# Altium schematic sheet Connections.SchDoc
size A; SheetNumber: 2; SheetTotal: 2
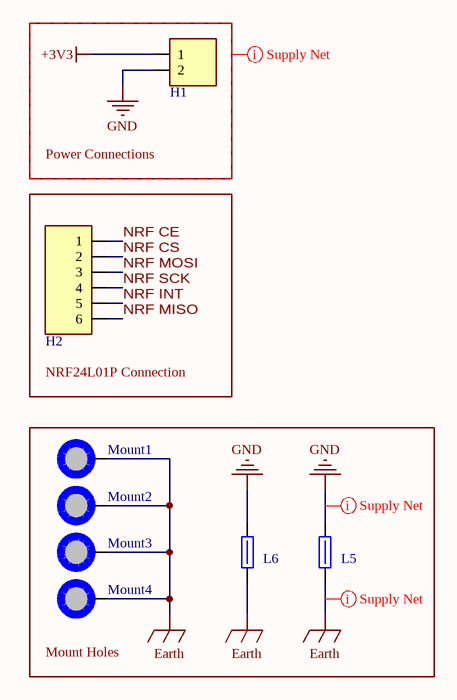
[diagram p0: Connections.SchDoc]

## Parts
H1  1x2 Male  [[Header] Shrouded 1x2 Male]  (value not drawn)
H2  [Header] Shrouded 1x6 Male  [[Header] Shrouded 1x6 Male]  (value not drawn)
L5  652-MH2029-300Y  [[Ferrite] SMD Bead 0805 (1)]  (value not drawn)
L6  652-MH2029-300Y  [[Ferrite] SMD Bead 0805 (1)]  (value not drawn)
Mount1  M3 Mount Hole  [[Mount] M3 Mount Hole]  (value not drawn)  (no BOM)
Mount2  M3 Mount Hole  [[Mount] M3 Mount Hole]  (value not drawn)  (no BOM)
Mount3  M3 Mount Hole  [[Mount] M3 Mount Hole]  (value not drawn)  (no BOM)
Mount4  M3 Mount Hole  [[Mount] M3 Mount Hole]  (value not drawn)  (no BOM)

## Blocks framed on the sheet
Power Connections: H1
NRF24L01P Connection: H2
Mount Holes: L5 L6 Mount1-Mount4

## Nets
+3V3: H1.1
Earth: L5.1 L6.1 Mount1.1 Mount2.1 Mount3.1 Mount4.1
GND: H1.2 L5.2 L6.2
NRF CE: H2.1
NRF CS: H2.2
NRF INT: H2.5
NRF MISO: H2.6
NRF MOSI: H2.3
NRF SCK: H2.4

## Layout directives
net class Supply_Nets: +3V3, Earth, GND

## Library data of the parts
H1 = [Header] Shrouded 1x2 Male: 0705430036 / Mates with 0050579402; Supplier 1: DigiKey; Supplier 2: DigiKey; Supplier Part Number 2: WM2900-ND; Supplier Part Number 1: WM4824-ND
H2 = [Header] Shrouded 1x6 Male: 0705430005 / Mates with 0050579406; Supplier 1: DigiKey; Supplier 2: DigiKey; Supplier Part Number 1: WM4804-ND; Supplier Part Number 2: WM2904-ND
L5 L6 = [Ferrite] SMD Ferrite Bead (1): Res @ Freq: 30 @ 100MHz; Size Package: 0805; Supplier 1: DigiKey; Supplier Part Number 1: MH2029-300YCT-ND
Mount1-Mount4 = [Mount] M3 Mount Hole: Place at least 4.5mm from board edge. Plated.